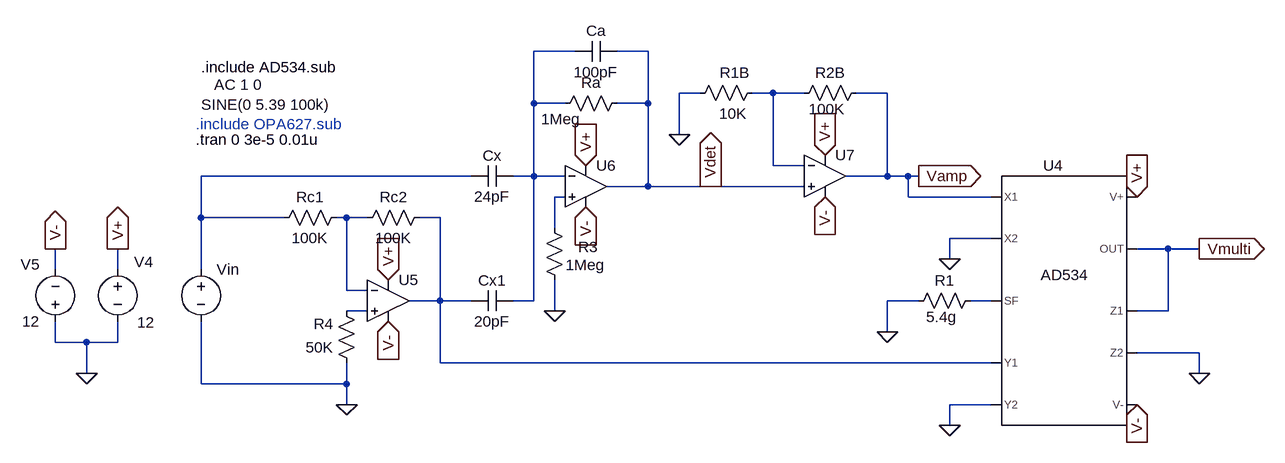
[diagram p0: schematic Ad534&Opamp.asc]
Ad534&Opamp.asc, the LTspice schematic file:
Version 4
SHEET 1 880 776
WIRE -528 -224 -592 -224
WIRE -416 -224 -464 -224
WIRE -336 -160 -368 -160
WIRE -224 -160 -256 -160
WIRE -176 -160 -224 -160
WIRE -48 -160 -96 -160
WIRE -592 -144 -592 -224
WIRE -544 -144 -592 -144
WIRE -416 -144 -416 -224
WIRE -416 -144 -464 -144
WIRE -368 -96 -368 -160
WIRE -224 -48 -224 -160
WIRE -176 -48 -224 -48
WIRE -688 -32 -1104 -32
WIRE -592 -32 -592 -144
WIRE -592 -32 -624 -32
WIRE -544 -32 -592 -32
WIRE -48 -32 -48 -160
WIRE -48 -32 -112 -32
WIRE -16 -32 -48 -32
WIRE 0 -32 -16 -32
WIRE -416 -16 -416 -144
WIRE -416 -16 -480 -16
WIRE -320 -16 -416 -16
WIRE -176 -16 -320 -16
WIRE -544 0 -560 0
WIRE -16 0 -16 -32
WIRE 112 0 -16 0
WIRE -1104 32 -1104 -32
WIRE -976 32 -1104 32
WIRE -880 32 -896 32
WIRE -848 32 -880 32
WIRE -736 32 -768 32
WIRE -560 48 -560 0
WIRE 112 64 48 64
WIRE 384 80 336 80
WIRE 432 80 384 80
WIRE 48 96 48 64
WIRE -1328 112 -1328 80
WIRE -1232 112 -1232 80
WIRE -1104 112 -1104 32
WIRE -880 144 -880 32
WIRE -848 144 -880 144
WIRE -736 160 -736 32
WIRE -736 160 -784 160
WIRE -688 160 -736 160
WIRE -592 160 -592 -32
WIRE -592 160 -624 160
WIRE 0 160 -48 160
WIRE 112 160 80 160
WIRE -848 176 -880 176
WIRE -560 176 -560 128
WIRE 384 176 384 80
WIRE 384 176 336 176
WIRE -48 208 -48 160
WIRE -1328 224 -1328 192
WIRE -1280 224 -1328 224
WIRE -1232 224 -1232 192
WIRE -1232 224 -1280 224
WIRE 432 240 336 240
WIRE -736 256 -736 160
WIRE 112 256 -736 256
WIRE -1280 272 -1280 224
WIRE 432 272 432 240
WIRE -1104 288 -1104 192
WIRE -880 288 -880 256
WIRE -880 288 -1104 288
WIRE -880 320 -880 288
WIRE 112 320 48 320
WIRE 48 352 48 320
FLAG -1232 80 V+
IOPIN -1232 80 Out
FLAG -816 192 V-
IOPIN -816 192 In
FLAG -816 128 V+
IOPIN -816 128 In
FLAG -880 320 0
FLAG -512 -48 V+
IOPIN -512 -48 In
FLAG -512 16 V-
IOPIN -512 16 In
FLAG -560 176 0
FLAG -1280 272 0
FLAG -1328 80 V-
IOPIN -1328 80 Out
FLAG -320 -16 Vdet
IOPIN -320 -16 Out
FLAG -144 -64 V+
IOPIN -144 -64 In
FLAG -144 0 V-
IOPIN -144 0 In
FLAG -368 -96 0
FLAG 0 -32 Vamp
IOPIN 0 -32 Out
FLAG 48 352 0
FLAG 48 96 0
FLAG -48 208 0
FLAG 336 0 V+
IOPIN 336 0 In
FLAG 336 320 V-
IOPIN 336 320 In
FLAG 432 272 0
FLAG 432 80 Vmulti
IOPIN 432 80 Out
SYMBOL voltage -1232 96 R0
WINDOW 0 25 4 Left 0
WINDOW 3 30 97 Left 0
SYMATTR InstName V4
SYMATTR Value 12
SYMBOL voltage -1328 208 R180
WINDOW 0 24 104 Left 0
WINDOW 3 24 16 Left 0
SYMATTR InstName V5
SYMATTR Value 12
SYMBOL res -752 16 R90
WINDOW 0 0 56 VBottom 0
WINDOW 3 32 56 VTop 0
SYMATTR InstName Rc2
SYMATTR Value 100K
SYMATTR SpiceLine tol=1
SYMBOL res -880 16 R90
WINDOW 0 0 56 VBottom 0
WINDOW 3 32 56 VTop 0
SYMATTR InstName Rc1
SYMATTR Value 100K
SYMATTR SpiceLine tol=1
SYMBOL res -864 272 R180
WINDOW 0 36 76 Left 0
WINDOW 3 36 40 Left 0
SYMATTR InstName R4
SYMATTR Value 50K
SYMATTR SpiceLine tol=1
SYMBOL voltage -1104 96 R0
WINDOW 3 0 -238 Left 0
WINDOW 123 20 -269 Left 0
WINDOW 39 0 0 Left 0
SYMATTR Value SINE(0 5.39 100k)
SYMATTR Value2 AC 1 0
SYMATTR InstName Vin
SYMBOL res -448 -160 R90
WINDOW 0 0 56 VBottom 0
WINDOW 3 25 102 VTop 0
SYMATTR InstName Ra
SYMATTR Value 1Meg
SYMATTR SpiceLine tol=1
SYMBOL cap -464 -240 R90
WINDOW 0 0 32 VBottom 0
WINDOW 3 32 32 VTop 0
SYMATTR InstName Ca
SYMATTR Value 100pF
SYMBOL cap -624 -48 R90
WINDOW 0 0 32 VBottom 0
WINDOW 3 32 32 VTop 0
SYMATTR InstName Cx
SYMATTR Value 24pF
SYMBOL cap -688 176 R270
WINDOW 0 32 32 VTop 0
WINDOW 3 0 32 VBottom 0
SYMATTR InstName Cx1
SYMATTR Value 20pF
SYMBOL res -544 144 R180
WINDOW 0 -51 67 Left 0
WINDOW 3 -62 39 Left 0
SYMATTR InstName R3
SYMATTR Value 1Meg
SYMATTR SpiceLine tol=1
SYMBOL res -80 -176 R90
WINDOW 0 0 56 VBottom 0
WINDOW 3 25 61 VTop 0
SYMATTR InstName R2B
SYMATTR Value 100K
SYMATTR SpiceLine tol=1
SYMBOL res -240 -176 R90
WINDOW 0 0 43 VBottom 0
WINDOW 3 32 45 VTop 0
SYMATTR InstName R1B
SYMATTR Value 10K
SYMATTR SpiceLine tol=1
SYMBOL ad534 224 160 R0
SYMATTR InstName U4
SYMBOL res 96 144 R90
WINDOW 0 0 56 VBottom 0
WINDOW 3 25 61 VTop 0
SYMATTR InstName R1
SYMATTR Value 5.4g
SYMATTR SpiceLine tol=1
SYMBOL Opamps\\UniversalOpamp2 -816 160 R0
SYMATTR InstName U5
SYMBOL Opamps\\UniversalOpamp2 -512 -16 R0
SYMATTR InstName U6
SYMBOL Opamps\\UniversalOpamp2 -144 -32 R0
SYMATTR InstName U7
TEXT -1112 -88 Left 0 !.tran 0 3e-5 0.01u
TEXT -1112 -112 Left 0 ;.include OPA627.sub
TEXT -1104 -200 Left 0 !.include AD534.sub

The netlist it stands for:
* Ad534&Opamp.asc
V4 V+ 0 12
V5 0 V- 12
Rc2 N006 N005 100K tol=1
Rc1 N005 N003 100K tol=1
R4 0 N008 50K tol=1
Vin N003 0 SINE(0 5.39 100k) AC 1 0
Ra Vdet N001 1Meg tol=1
Ca Vdet N001 100pF
Cx N001 N003 24pF
Cx1 N006 N001 20pF
R3 0 N004 1Meg tol=1
R2B Vamp N002 100K tol=1
R1B N002 0 10K tol=1
XU4 Vamp 0 N007 N006 0 V+ Vmulti Vmulti 0 V- AD534  ; pins X1 X2 SF Y1 Y2 V+ OUT Z1 Z2 V-
R1 N007 0 5.4g tol=1
XU5 N008 N005 V+ V- N006 level.2 Avol=1Meg GBW=10Meg Slew=10Meg ilimit=25m rail=0 Vos=0 phimargin=45 en=0 enk=0 in=0 ink=0 Rin=500Meg  ; pins IN+ IN- V+ V- OUT
XU6 N004 N001 V+ V- Vdet level.2 Avol=1Meg GBW=10Meg Slew=10Meg ilimit=25m rail=0 Vos=0 phimargin=45 en=0 enk=0 in=0 ink=0 Rin=500Meg  ; pins IN+ IN- V+ V- OUT
XU7 Vdet N002 V+ V- Vamp level.2 Avol=1Meg GBW=10Meg Slew=10Meg ilimit=25m rail=0 Vos=0 phimargin=45 en=0 enk=0 in=0 ink=0 Rin=500Meg  ; pins IN+ IN- V+ V- OUT
.tran 0 3e-5 0.01u
* .include OPA627.sub
.include AD534.sub
.lib UniversalOpamps2.sub
.backanno
.end